# Altium schematic sheet harvesting.SchDoc
size Letter
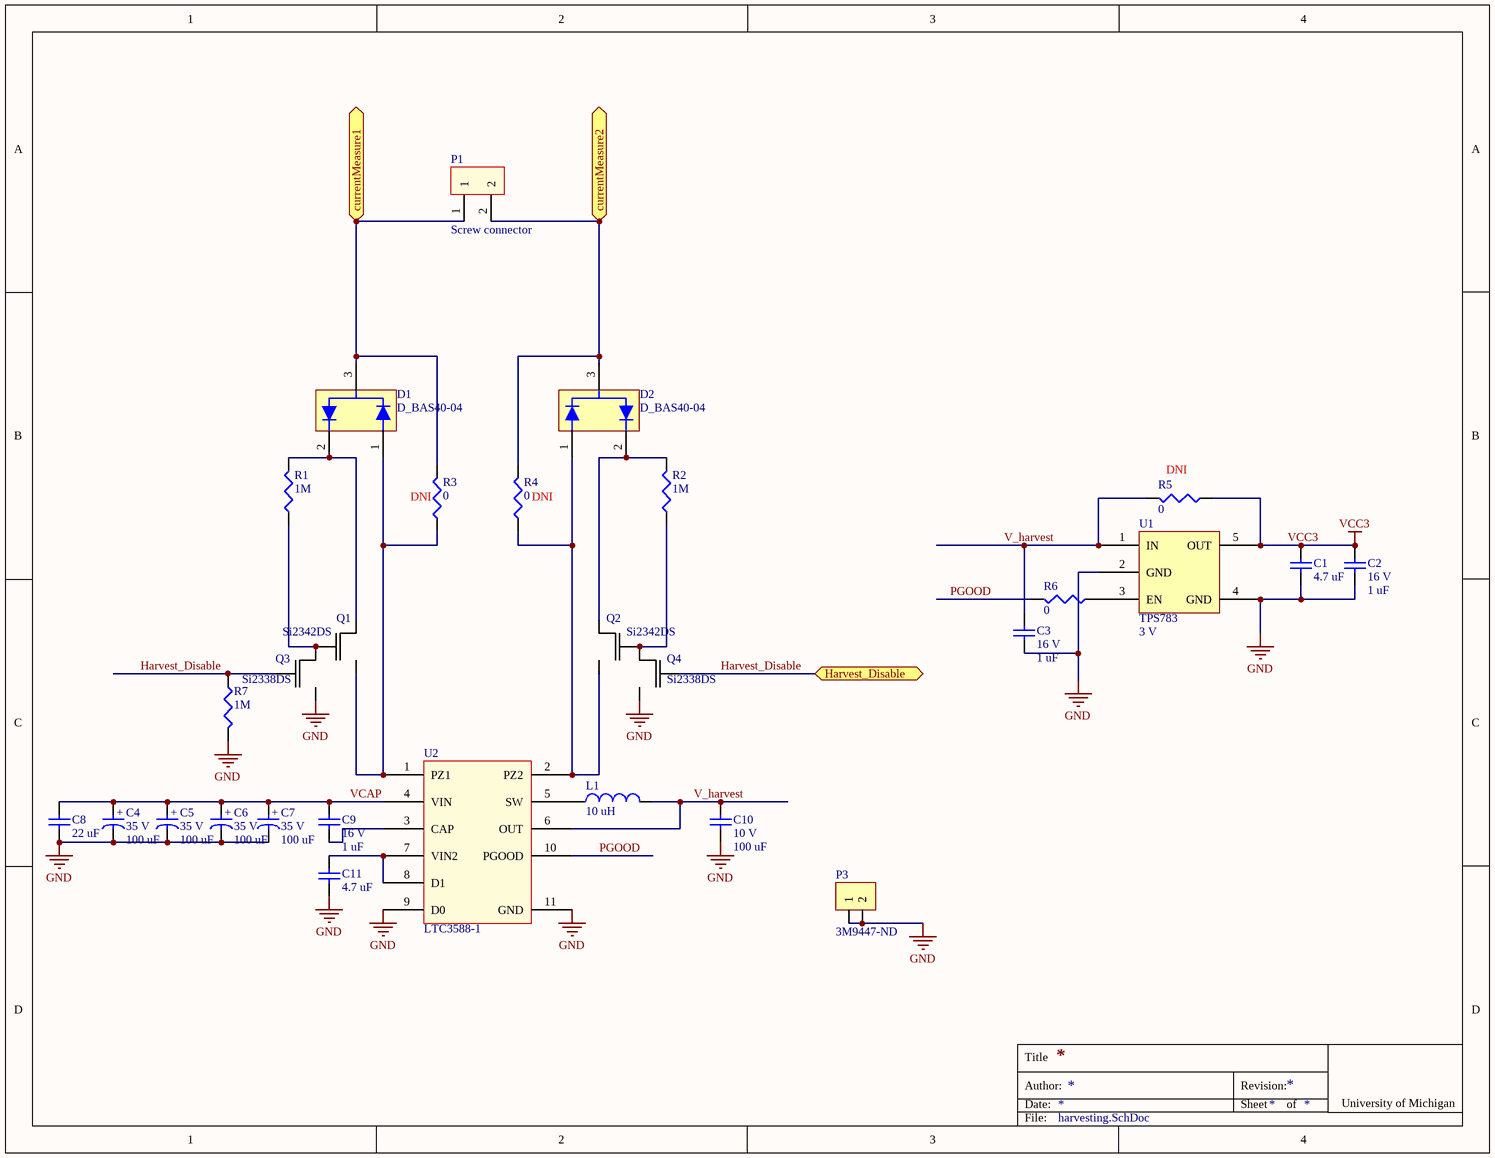
[diagram p0: harvesting.SchDoc]

## Parts
C1  value 4.7 uF  [0603]  (hidden comment: Ceramic capacitor)
C2  value 1 uF  voltage rated: 16 V  [0603]  (hidden comment: Ceramic capacitor)
C3  value 1 uF  voltage rated: 16 V  [0603]  (hidden comment: Ceramic capacitor)
C4  value 100 uF  voltage rated: 35 V  [KEMET_EDK_9H]  (hidden comment: Aluminum capacitor)
C5  value 100 uF  voltage rated: 35 V  [KEMET_EDK_9H]  (hidden comment: Aluminum capacitor)
C6  value 100 uF  voltage rated: 35 V  [KEMET_EDK_9H]  (hidden comment: Aluminum capacitor)
C7  value 100 uF  voltage rated: 35 V  [KEMET_EDK_9H]  (hidden comment: Aluminum capacitor)
C8  value 22 uF  [1206]  (hidden comment: Ceramic capacitor)
C9  value 1 uF  voltage rated: 16 V  [0603]  (hidden comment: Ceramic capacitor)
C10  value 100 uF  voltage rated: 10 V  [1210]  (hidden comment: Ceramic capacitor)
C11  value 4.7 uF  [0603]  (hidden comment: Ceramic capacitor)
D1  D_BAS40-04  [SOT23-3]
D2  D_BAS40-04  [SOT23-3]
L1  value 10 uH  [CDRH2D18]  (hidden comment: Chip inductor)
P1  Screw connector  [MPT_2position]
P3  Supplier Part Number 1: 3M9447-ND  [1x2 header]  (hidden comment: 1 x 2 header)
Q1  Si2342DS  [SOT23-3]
Q2  Si2342DS  [SOT23-3]
Q3  Si2338DS  [SOT23-3]
Q4  Si2338DS  [SOT23-3]
R1  value 1M  [0603]  (hidden comment: Chip resistor)
R2  value 1M  [0603]  (hidden comment: Chip resistor)
R3  value 0  [0603]  (hidden comment: Chip resistor)
R4  value 0  [0603]  (hidden comment: Chip resistor)
R5  value 0  [0603]  (hidden comment: Chip resistor)
R6  value 0  [0603]  (hidden comment: Chip resistor)
R7  value 1M  [0603]  (hidden comment: Chip resistor)
U1  TPS783  Output Voltage: 3 V  [SOT23-5]
U2  LTC3588-1  [TSSOP50P490X110_HS-11N]

## Ports
currentMeasure1, currentMeasure2, Harvest_Disable

## Nets
GND: C1.2 C2.2 C3.2 C4.2 C5.2 C6.2 C7.2 C8.2 C10.2 C11.2 P3.1 P3.2 Q3.2(S) Q4.2(S) R7.1 U1.2(GND) U1.4(GND) U2.9(D0) U2.11(GND)
VCC3: C1.1 C2.1 R5.2 U1.5(OUT)
currentMeasure1: D1.3 P1.1 R3.1 ; port currentMeasure1
currentMeasure2: D2.3 P1.2 R4.1 ; port currentMeasure2
Harvest_Disable: Q3.1(G) Q4.1(G) R7.2 ; port Harvest_Disable
PGOOD: R6.1 U2.10(PGOOD)
V_harvest: C3.1 C10.1 L1.1 R5.1 U1.1(IN) U2.6(OUT)
VCAP: C4.1 C5.1 C6.1 C7.1 C8.1 C9.1 U2.4(VIN)
NetC9_2: C9.2 U2.3(CAP)
NetC11_1: C11.1 U2.7(VIN2) U2.8(D1)
NetD1_1: D1.1 Q1.2(S) R3.2 U2.1(PZ1)
NetD1_2: D1.2 Q1.3(D) R1.1
NetD2_1: D2.1 Q2.2(S) R4.2 U2.2(PZ2)
NetD2_2: D2.2 Q2.3(D) R2.1
NetL1_2: L1.2 U2.5(SW)
NetQ1_1: Q1.1(G) Q3.3(D) R1.2
NetQ2_1: Q2.1(G) Q4.3(D) R2.2
NetR6_2: R6.2 U1.3(EN)

## Notes on the sheet
- (near R3) DNI
- (near R4) DNI
- (near R5) DNI
- Title
- Date:
- Author:
- Revision:
- Sheet
- of
- University of Michigan
- File:
- (in symbol C_100u_35V_aluminum) +

## Library data of the parts
C1 C11 = C_4.7u_10V_0603_ceramic: Ceramic capacitor, 4.7u, 10V, 0603 package; Manufacture: TDK; tolerance: 20%; Temp rating: X5R; package: 0603; voltage rated: 10 V; Supplier 1: Digi-Key; Supplier Part Number 1: 445-7482-1-ND
C2 C3 C9 = C_1u_16V_0603_ceramic: Ceramic capacitor, 1 uF, 16 V, 0603 package; Manufacture: TDK; tolerance: 10%; package: 0603; Supplier 1: Digi-Key; Supplier Part Number 1: 445-1604-1-ND
C4-C7 = C_100u_35V_aluminum: Aluminum capacitor, 100 uF, 35 V, KEMET EDK 9H; tolerance: 20%; Manufacture: Kemet; Supplier 1: Digi-Key; Supplier Part Number 1: 399-6671-1-ND
C8 = C_22u_35V_1206_ceramic: Ceramic capacitor, 22 uF, 35 V, 1206 package; Manufacture: TDK; voltage rated: 35 V; tolerance: 20%; package: 1206; Supplier 1: Digi-Key; Supplier Part Number 1: 445-8045-1-ND
C10 = C_100u_10V_1210_ceramic: Ceramic capacitor, 100u, 1210 package; Manufacture: Samsung; tolerance: 20%; package: 2917; Supplier 1: Digi-Key; Supplier Part Number 1: 1276-3364-1-ND
D1 D2 = D_BAS40-04: SURFACE MOUNT SCHOTTKY BARRIER DIODE; Supplier 1: Digi-Key; Supplier Part Number 1: BAS40-04FDICT-ND
L1 = L_10uH_1A_180m: Chip inductor, 10 uH,  1A, 180 mOhm; tolerance: 30%; Supplier 1: Digi-Key; Supplier Part Number 1: 308-1959-1-ND
P1 = MPT_2POS: Screw connector 2 positions; Supplier 1: Digi-Key; Supplier Part Number 1: 277-1273-ND
P3 = 1 x 2 header: 100 mils standard header; Supplier 1: Digi-Key
Q1 Q2 = Si2342DS: N-Channel 8 V (D-S) MOSFET; Supplier 1: Digi-Key; Supplier Part Number 1: SI2342DS-T1-GE3-ND
Q3 Q4 = Si2338DS: N-Channel 30 V (D-S) MOSFET; Supplier 1: Digi-Key; Supplier Part Number 1: SI2338DS-T1-GE3CT-ND
R1 R2 R7 = R_1M_0603: Chip resistor, 1 Meg, 0603 package; tolerance: 1%; power: 1/10 W; package: 0603; Supplier 1: Digi-Key; Supplier Part Number 1: 541-1.00MHCT-ND
R3-R6 = R_0_0603: Chip resistor, 0, 0603 package; package: 0603; Supplier 1: Digi-Key; Supplier Part Number 1: 541-0.0GCT-ND
U1 = TPS783: TPS783xx 500-nA IQ, 150-mA, Ultralow Quiescent Current  Low-Dropout Linear Regulator; Supplier 1: Digi-Key; Supplier Part Number 1: 296-25880-1-ND
U2 = LTC3588-1: Piezoelectric Energy   Harvesting Power Supply; Supplier 1: Digi-Key; Supplier Part Number 1: LTC3588EMSE-1#PBF-ND